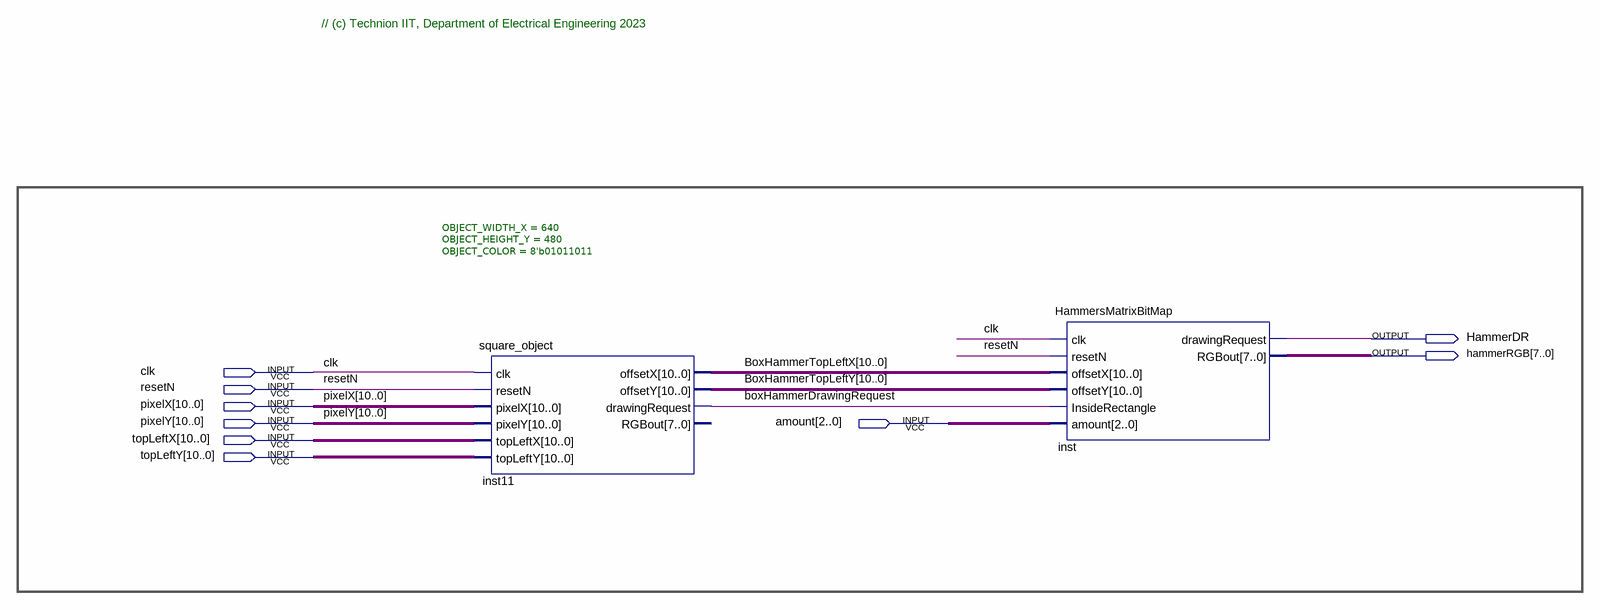
[diagram p0: schematic sheet]
// Quartus schematic HAMMER_DISPLAY.bdf as structural Verilog: 2 symbols, 9 pins
module HAMMER_DISPLAY (
  input  clk,
  input  resetN,
  input  [10:0] pixelX,
  input  [10:0] pixelY,
  input  [2:0] amount,
  input  [10:0] topLeftX,
  input  [10:0] topLeftY,
  output HammerDR,
  output [7:0] hammerRGB
);

  wire boxHammerDrawingRequest;
  wire [10:0] BoxHammerTopLeftX, BoxHammerTopLeftY;

  square_object #(.OBJECT_WIDTH_X(640), .OBJECT_HEIGHT_Y(480), .OBJECT_COLOR(8'b01011011)) inst11 (
    .clk(clk), .resetN(resetN), .pixelX(pixelX), .pixelY(pixelY), .topLeftX(topLeftX), .topLeftY(topLeftY),
    .offsetX(BoxHammerTopLeftX), .offsetY(BoxHammerTopLeftY), .drawingRequest(boxHammerDrawingRequest));  // open: RGBout
  HammersMatrixBitMap inst (
    .clk(clk), .resetN(resetN), .offsetX(BoxHammerTopLeftX), .offsetY(BoxHammerTopLeftY),
    .InsideRectangle(boxHammerDrawingRequest), .amount(amount), .drawingRequest(HammerDR), .RGBout(hammerRGB));

  // Notes on the sheet:
  //   // (c) Technion IIT, Department of Electrical Engineering 2023
endmodule
